# Altium project Touch_Nightlight.PrjPcb
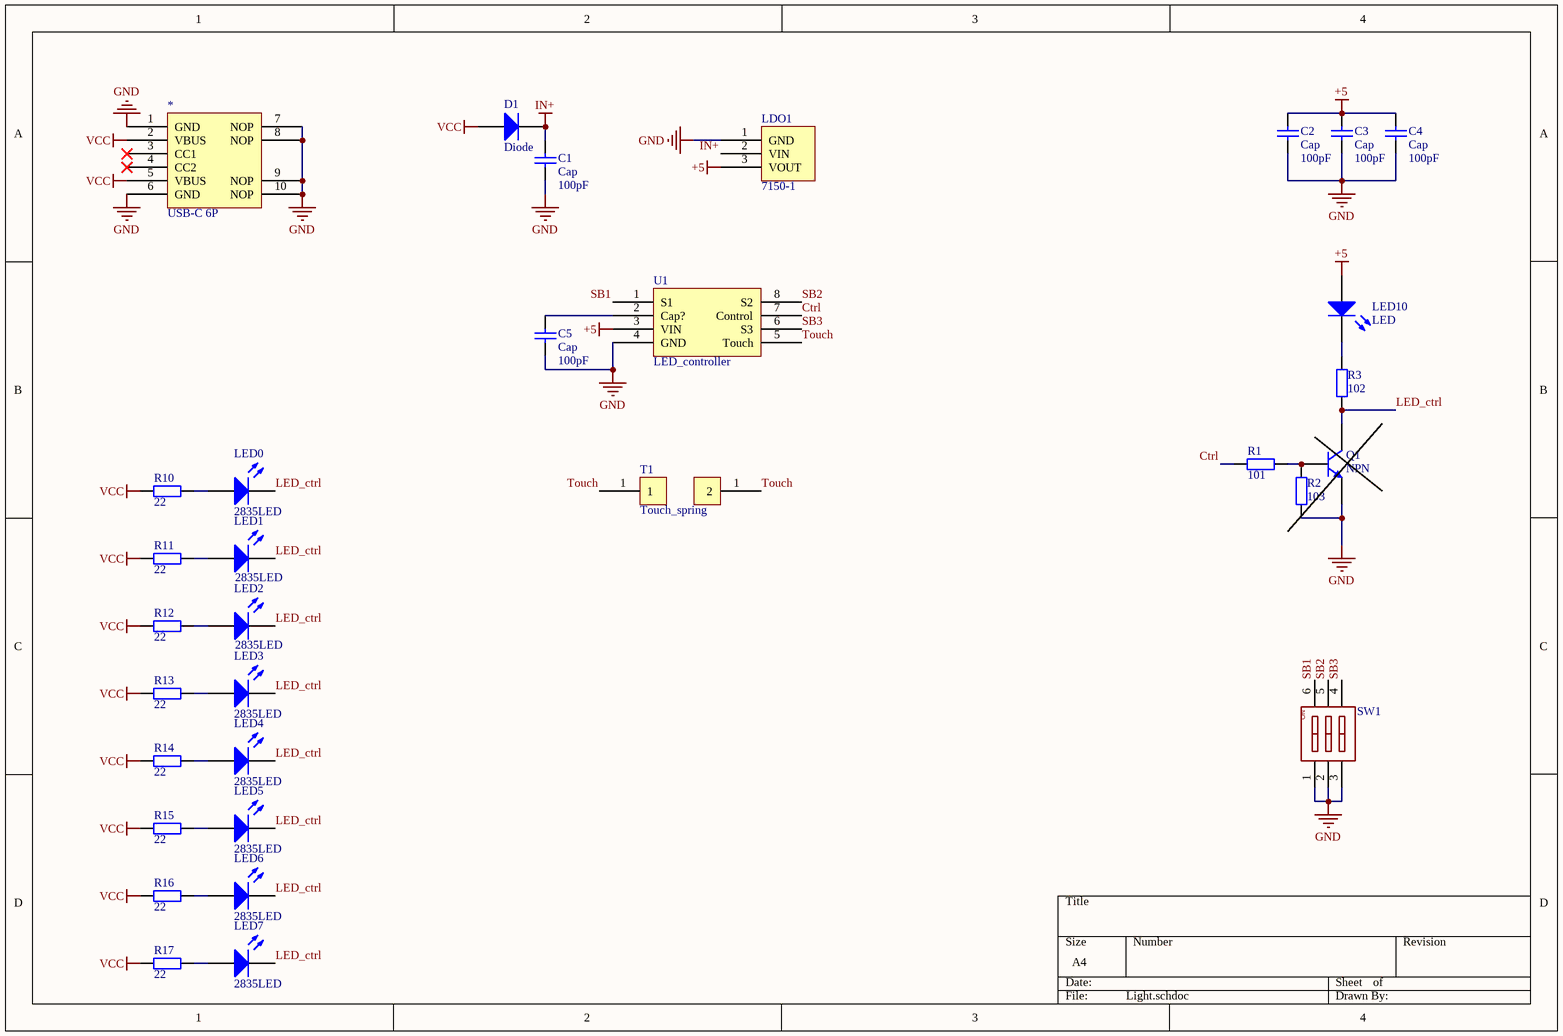
[diagram p0: Light.schdoc]
1 sheet, 32 parts. Net scope: global (net labels, ports and power ports of the same name join across sheets).
Board file: PCB.pcbdoc

## Sheet Light.schdoc
size A4; SheetNumber: 1; SheetTotal: 1; SPICEModelCacheDYNRQAFH: <root> / <DocumentId>DYNRQAFH</DocumentId> / <CacheFrame Number="0"> / <Model Name="cap" Kind="MDL"> / <Text>*Default semiconductor capacitor / .MODEL CAP C()</Text> / </Model> / <Model Name="diode" Kind="MDL"> / <Text>*Default Diode / *Diode Pinout: A,K / .MODEL DIODE D()</Text> / </Model> / <Model Name="led0" Kind="MDL"> / <Text>*Typ INFRARED GaAs LED: Vf=1.2V Vr=5V If=40mA trr=3uS / *LED Pinout: 1=A, 2=K / .MODEL LED0 D (IS=93.5P RS=84M N=2.63 BV=5 IBV=10U / + CJO=2.97P VJ=.75 M=.333 TT=4.32U)</Text> / </Model> / <Model Name="npn" Kind="MDL"> / <Text>*Default NPN BJT / *NPN Trans Pinout: C,B,E / .MODEL NPN NPN()</Text> / </Model> / </CacheFrame> / </root>

### Parts
*  USB-C 6P  [USB-C 6P]
C1  Cap  value 100pF  [6-0805_M]
C2  Cap  value 100pF  [1608[0603]]
C3  Cap  value 100pF  [1608[0603]]
C4  Cap  value 100pF  [1608[0603]]
C5  Cap  value 100pF  [1608[0603]]
D1  Diode  [SOD-123]
LDO1  7150-1  [SOT-89]
LED0  2835LED  [2835LED]
LED1  2835LED  [2835LED]
LED2  2835LED  [2835LED]
LED3  2835LED  [2835LED]
LED4  2835LED  [2835LED]
LED5  2835LED  [2835LED]
LED6  2835LED  [2835LED]
LED7  2835LED  [2835LED]
LED10  LED  [LED]
Q1  NPN  [SOT23]
R1  101  [1608[0603]]
R2  103  [1608[0603]]
R3  102  [1608[0603]]
R10  22  [R1206]
R11  22  [R1206]
R12  22  [R1206]
R13  22  [R1206]
R14  22  [R1206]
R15  22  [R1206]
R16  22  [R1206]
R17  22  [R1206]
SW1  SD03H0SB  [SW-SMD_3]  (value not drawn)
T1  Touch_spring  [Touch_spring2]
U1  LED_controller  [SOP8]

### Nets
+5: C2.2 C3.2 C4.2 LDO1.3(VOUT) LED10.1(A) U1.3(VIN)
GND: *.1(GND) *.6(GND) *.7(NOP) *.8(NOP) *.9(NOP) *.10(NOP) C1.1 C2.1 C3.1 C4.1 C5.1 LDO1.1(GND) Q1.3(E) R2.1 SW1.1(A1) SW1.2(A2) SW1.3(A3) U1.4(GND)
IN+: C1.2 D1.2(K) LDO1.2(VIN)
VCC: *.2(VBUS) *.5(VBUS) D1.1(A) R10.1 R11.1 R12.1 R13.1 R14.1 R15.1 R16.1 R17.1
Ctrl: R1.1 U1.7(Control)
LED_ctrl: LED0.2(K) LED1.2(K) LED2.2(K) LED3.2(K) LED4.2(K) LED5.2(K) LED6.2(K) LED7.2(K) Q1.1(C) R3.2
SB1: SW1.6(A6) U1.1(S1)
SB2: SW1.5(A5) U1.8(S2)
SB3: SW1.4(A4) U1.6(S3)
Touch: T1.1 U1.5(Touch)
NetC5_2: C5.2 U1.2(Cap?)
NetLED0_1: LED0.1(A) R10.2
NetLED1_1: LED1.1(A) R11.2
NetLED2_1: LED2.1(A) R12.2
NetLED3_1: LED3.1(A) R13.2
NetLED4_1: LED4.1(A) R14.2
NetLED5_1: LED5.1(A) R15.2
NetLED6_1: LED6.1(A) R16.2
NetLED7_1: LED7.1(A) R17.2
NetLED10_2: LED10.2(K) R3.1
NetQ1_2: Q1.2(B) R1.2 R2.2

Not connected (* = marked no-connect by the designer): * 3(CC1)* 4(CC2)*

### Notes on the sheet
- (in symbol SW Dial-3) ON

### Library data of the parts
C1-C5 = Cap: Capacitor; Published: 8-Jun-2000; LatestRevisionDate: 17-Jul-2002; LatestRevisionNote: Re-released for DXP Platform.; PackageReference: RAD-0.3; Publisher: Altium Limited; PackageDescription: Radial Cap, Thru-Hole; 2 Leads; 0.3 in Pin Spacing
D1 = Diode: Default Diode; Published: 8-Jun-2000; LatestRevisionDate: 17-Jul-2002; LatestRevisionNote: Re-released for DXP Platform.; PackageVersion: Sep-1996; PackageReference: SMC; Publisher: Altium Limited; PackageDescription: DO-214-AB/SMC; 2 C-Bend Leads; Body 7.9 x 5.9 mm, inc. leads (LxW); Code_JEDEC: DO-214-AB
LED10 = LED: Typical INFRARED GaAs LED; Published: 8-Jun-2000; LatestRevisionDate: 08-Jul-2005; LatestRevisionNote: Mech Layer 1 removed.; PackageReference: LED-0; Publisher: Altium Limited; PackageDescription: LED; 2 Leads
Q1 = NPN: NPN Bipolar Transistor; Published: 8-Jun-2000; LatestRevisionDate: 17-Jul-2002; LatestRevisionNote: Re-released for DXP Platform.; PackageReference: TO-226-AA; Publisher: Altium Limited; PackageDescription: TO, Flat Index; 3 In-Line, Axial Leads; Body Dia. 4.8mm; Leads 0.55 x 0.51 mm (max); Code_JEDEC: TO-226-AA
R1-R3 R10-R17 = Res: Resistor; Published: 8-Jun-2000; LatestRevisionDate: 17-Jul-2002; LatestRevisionNote: Re-released for DXP Platform.; PackageReference: AXIAL-0.4; Publisher: Altium Limited; PackageDescription: Axial Device, Thru-Hole; 2 Leads; 0.4 in Pin Spacing
SW1 = SW Dial-3